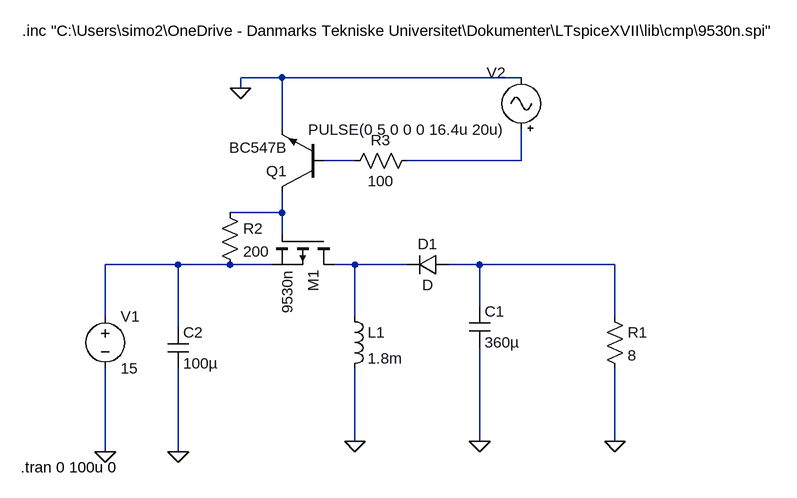
[diagram p0: schematic BuckBoost_P-Channel-switch.asc]
BuckBoost_P-Channel-switch.asc, the LTspice schematic file:
Version 4
SHEET 1 1176 680
WIRE 272 -128 208 -128
WIRE 640 -128 272 -128
WIRE 208 -112 208 -128
WIRE 272 -48 272 -128
WIRE 384 0 336 0
WIRE 640 0 640 -48
WIRE 640 0 464 0
WIRE 272 80 272 48
WIRE 272 80 192 80
WIRE 272 112 272 80
WIRE 112 160 0 160
WIRE 192 160 112 160
WIRE 256 160 192 160
WIRE 384 160 352 160
WIRE 464 160 384 160
WIRE 576 160 528 160
WIRE 784 160 576 160
WIRE 576 224 576 160
WIRE 0 240 0 160
WIRE 384 240 384 160
WIRE 784 240 784 160
WIRE 112 256 112 160
WIRE 384 432 384 320
WIRE 576 432 576 288
WIRE 784 432 784 320
WIRE 0 448 0 320
WIRE 112 448 112 320
FLAG 0 448 0
FLAG 208 -112 0
FLAG 384 432 0
FLAG 112 448 0
FLAG 576 432 0
FLAG 784 432 0
SYMBOL pmos 352 112 R90
SYMATTR InstName M1
SYMATTR Value 9530n
SYMATTR Prefix X
SYMBOL voltage 0 224 R0
WINDOW 123 0 0 Left 0
WINDOW 39 0 0 Left 0
SYMATTR InstName V1
SYMATTR Value 15
SYMBOL npn 336 48 R180
SYMATTR InstName Q1
SYMATTR Value BC547B
SYMBOL res 176 64 R0
SYMATTR InstName R2
SYMATTR Value 200
SYMBOL Misc\\signal 640 -32 R180
WINDOW 0 24 104 Left 2
WINDOW 3 24 16 Left 2
WINDOW 123 0 0 Left 0
WINDOW 39 0 0 Left 0
SYMATTR InstName V2
SYMATTR Value PULSE(0 5 0 0 0 16.4u 20u)
SYMBOL res 480 -16 R90
WINDOW 0 0 56 VBottom 2
WINDOW 3 32 56 VTop 2
SYMATTR InstName R3
SYMATTR Value 100
SYMBOL cap 560 224 R0
SYMATTR InstName C1
SYMATTR Value 360µ
SYMBOL cap 96 256 R0
SYMATTR InstName C2
SYMATTR Value 100µ
SYMBOL ind 368 224 R0
SYMATTR InstName L1
SYMATTR Value 1.8m
SYMBOL diode 528 144 R90
WINDOW 0 0 32 VBottom 2
WINDOW 3 32 32 VTop 2
SYMATTR InstName D1
SYMBOL res 768 224 R0
SYMATTR InstName R1
SYMATTR Value 8
TEXT -128 -200 Left 2 !.inc "C:\\Users\\simo2\\OneDrive - Danmarks Tekniske Universitet\\Dokumenter\\LTspiceXVII\\lib\\cmp\\9530n.spi"
TEXT -130 472 Left 2 !.tran 0 100u 0

The netlist it stands for:
* BuckBoost_P-Channel-switch.asc
XM1 N005 N003 N004 9530n  ; pins D G S
V1 N004 0 15
Q1 N003 N001 0 0 BC547B
R2 N003 N004 200
V2 N002 0 PULSE(0 5 0 0 0 16.4u 20u)
R3 N002 N001 100
C1 N006 0 360µ
C2 N004 0 100µ
L1 N005 0 1.8m
D1 N006 N005 D
R1 N006 0 8
.model D D
.lib standard.dio
.model NPN NPN
.model PNP PNP
.lib standard.bjt
.inc "C:\Users\simo2\OneDrive - Danmarks Tekniske Universitet\Dokumenter\LTspiceXVII\lib\cmp\9530n.spi"
.tran 0 100u 0
.backanno
.end